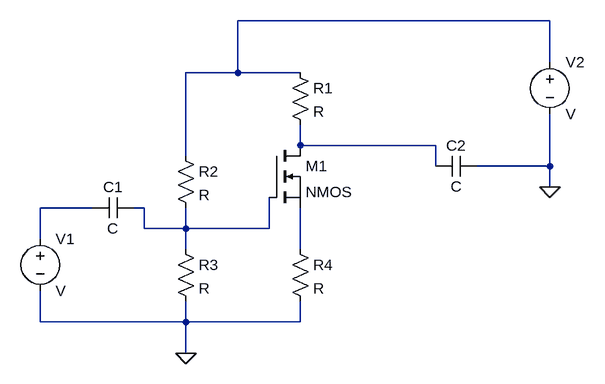
[diagram p0: schematic Draft7.asc]
Draft7.asc, the LTspice schematic file:
Version 4
SHEET 1 880 680
WIRE 608 -80 128 -80
WIRE 608 -16 608 -80
WIRE 128 0 128 -80
WIRE 128 0 48 0
WIRE 224 0 128 0
WIRE 224 112 224 80
WIRE 432 112 224 112
WIRE 48 128 48 0
WIRE 432 144 432 112
WIRE 608 144 608 64
WIRE 608 144 496 144
WIRE 608 176 608 144
WIRE -96 208 -176 208
WIRE -16 208 -32 208
WIRE -16 240 -16 208
WIRE 48 240 48 208
WIRE 48 240 -16 240
WIRE 176 240 176 192
WIRE 176 240 48 240
WIRE -176 256 -176 208
WIRE 48 272 48 240
WIRE 224 272 224 208
WIRE -176 384 -176 336
WIRE 48 384 48 352
WIRE 48 384 -176 384
WIRE 224 384 224 352
WIRE 224 384 48 384
WIRE 48 432 48 384
FLAG 608 176 0
FLAG 48 432 0
SYMBOL nmos 176 112 R0
SYMATTR InstName M1
SYMBOL cap -32 192 R90
WINDOW 0 0 32 VBottom 2
WINDOW 3 32 32 VTop 2
SYMATTR InstName C1
SYMBOL cap 496 128 R90
WINDOW 0 0 32 VBottom 2
WINDOW 3 32 32 VTop 2
SYMATTR InstName C2
SYMBOL voltage -176 240 R0
SYMATTR InstName V1
SYMBOL voltage 608 -32 R0
SYMATTR InstName V2
SYMBOL res 208 -16 R0
SYMATTR InstName R1
SYMBOL res 32 112 R0
SYMATTR InstName R2
SYMBOL res 32 256 R0
SYMATTR InstName R3
SYMBOL res 208 256 R0
SYMATTR InstName R4

The netlist it stands for:
* Draft7.asc
M1 N002 N004 N005 N005 NMOS
C1 N004 N003 C
C2 0 N002 C
V1 N003 0 V
V2 N001 0 V
R1 N001 N002 R
R2 N001 N004 R
R3 N004 0 R
R4 N005 0 R
.model NMOS NMOS
.model PMOS PMOS
.lib standard.mos
.backanno
.end